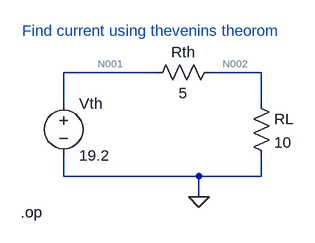
[diagram p0: schematic EEE_1_new_4.asc]
EEE_1_new_4.asc, the LTspice schematic file:
Version 4
SHEET 1 880 680
WIRE 128 112 -16 112
WIRE 288 112 208 112
WIRE -16 160 -16 112
WIRE 288 160 288 112
WIRE -16 272 -16 240
WIRE 192 272 -16 272
WIRE 288 272 288 240
WIRE 288 272 192 272
WIRE 192 304 192 272
FLAG 192 304 0
SYMBOL voltage -16 144 R0
SYMATTR InstName Vth
SYMATTR Value 19.2
SYMBOL res 224 96 R90
WINDOW 0 0 56 VBottom 2
WINDOW 3 32 56 VTop 2
SYMATTR InstName Rth
SYMATTR Value 5
SYMBOL res 272 144 R0
SYMATTR InstName RL
SYMATTR Value 10
TEXT -80 48 Left 2 ;Find current using thevenins theorom
TEXT -82 328 Left 2 !.op

The netlist it stands for:
* EEE_1_new_4.asc
Vth N001 0 19.2
Rth N002 N001 5
RL N002 0 10
* Find current using thevenins theorom
.op
.backanno
.end

* Results of the author's LTspice run, read from the files saved beside the schematic
* Operating Point:
*   V(n001) = 19.2 V
*   V(n002) = 12.8 V
*   I(Rl) = 1.28 A
*   I(Rth) = -1.28 A
*   I(Vth) = -1.28 A